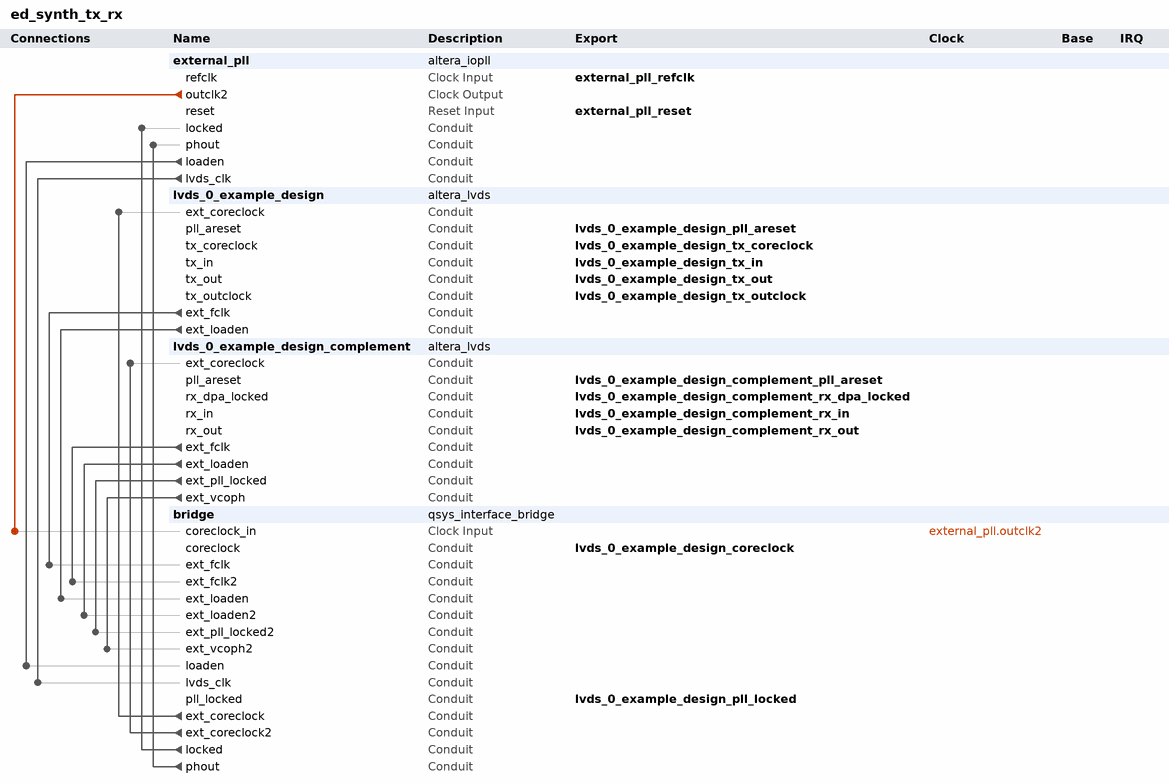
[diagram p0: system contents]
# Platform Designer (Qsys) system ed_synth_tx_rx, Cyclone 10 GX 10CX220YF780E5G
# Parameters at their usual value, and those the tool derives, are not listed.
package require -exact qsys 1.0
create_system ed_synth_tx_rx
set_project_property DEVICE_FAMILY {Cyclone 10 GX}
set_project_property DEVICE 10CX220YF780E5G

add_component external_pll ip/ed_synth_tx_rx/ed_synth_tx_rx_external_pll.ip altera_iopll external_pll 19.3.1
load_component external_pll
set_component_parameter_value gui_device_family {Cyclone 10 GX}
set_component_parameter_value gui_device_component 10CX220YF780E5G
set_component_parameter_value gui_device_speed_grade 5
set_component_parameter_value gui_debug_mode false
set_component_parameter_value gui_skip_sdc_generation false
set_component_parameter_value gui_include_iossm false
set_component_parameter_value gui_cal_code_hex_file iossm.hex
set_component_parameter_value gui_parameter_table_hex_file seq_params_sim.hex
set_component_parameter_value gui_pll_tclk_mux_en false
set_component_parameter_value gui_pll_tclk_sel pll_tclk_m_src
set_component_parameter_value gui_pll_vco_freq_band_0 pll_freq_clk0_band18
set_component_parameter_value gui_pll_vco_freq_band_1 pll_freq_clk1_band18
set_component_parameter_value gui_pll_freqcal_en true
set_component_parameter_value gui_pll_freqcal_req_flag true
set_component_parameter_value gui_cal_converge false
set_component_parameter_value gui_cal_error cal_clean
set_component_parameter_value gui_pll_cal_done false
set_component_parameter_value gui_pll_type S10_Simple
set_component_parameter_value gui_pll_m_cnt_in_src c_m_cnt_in_src_ph_mux_clk
set_component_parameter_value gui_c_cnt_in_src0 c_m_cnt_in_src_ph_mux_clk
set_component_parameter_value gui_c_cnt_in_src1 c_m_cnt_in_src_ph_mux_clk
set_component_parameter_value gui_c_cnt_in_src2 c_m_cnt_in_src_ph_mux_clk
set_component_parameter_value system_info_device_family {Cyclone 10 GX}
set_component_parameter_value system_info_device_component 10CX220YF780E5G
set_component_parameter_value system_info_device_speed_grade 5
set_component_parameter_value system_part_trait_speed_grade 5
set_component_parameter_value gui_usr_device_speed_grade 1
set_component_parameter_value gui_location_type {I/O Bank}
set_component_parameter_value gui_use_logical false
set_component_parameter_value gui_reference_clock_frequency 40.0
set_component_parameter_value gui_reference_clock_frequency_ps 10000.0
set_component_parameter_value gui_use_coreclk false
set_component_parameter_value gui_refclk_might_change false
set_component_parameter_value gui_prot_mode UNUSED
set_component_parameter_value gui_use_locked true
set_component_parameter_value gui_lock_setting {Low Lock Time}
set_component_parameter_value gui_en_lvds_ports {Enable LVDS_CLK/LOADEN 0}
set_component_parameter_value gui_operation_mode direct
set_component_parameter_value gui_clock_to_compensate 0
set_component_parameter_value gui_use_NDFB_modes false
set_component_parameter_value gui_en_phout_ports true
set_component_parameter_value gui_number_of_clocks 3
set_component_parameter_value gui_fix_vco_frequency true
set_component_parameter_value gui_fixed_vco_frequency 1280.0
set_component_parameter_value gui_fixed_vco_frequency_ps 1667.0
set_component_parameter_value gui_vco_frequency 600.0
set_component_parameter_value gui_mif_gen_options {Generate New MIF File}
set_component_parameter_value gui_new_mif_file_path {~/pll.mif}
set_component_parameter_value gui_existing_mif_file_path {~/pll.mif}
set_component_parameter_value gui_mif_config_name unnamed
set_component_parameter_value gui_enable_permit_cal false
set_component_parameter_value gui_clock_name_global false
set_component_parameter_value gui_output_clock_frequency0 1280.0
set_component_parameter_value gui_output_clock_frequency1 160.0
set_component_parameter_value gui_output_clock_frequency2 160.0
set_component_parameter_value gui_output_clock_frequency_ps0 10000.0
set_component_parameter_value gui_output_clock_frequency_ps1 10000.0
set_component_parameter_value gui_output_clock_frequency_ps2 10000.0
set_component_parameter_value gui_actual_output_clock_frequency0 1280.0
set_component_parameter_value gui_actual_output_clock_frequency1 160.0
set_component_parameter_value gui_actual_output_clock_frequency2 160.0
set_component_parameter_value gui_actual_output_clock_frequency_range0 213.333333,256.0,320.0,426.666667,640.0,1280.0
set_component_parameter_value gui_actual_output_clock_frequency_range1 116.363636,128.0,142.222222,160.0,182.857143,213.333333
set_component_parameter_value gui_actual_output_clock_frequency_range2 116.363636,128.0,142.222222,160.0,182.857143,213.333333
set_component_parameter_value gui_phase_shift0 391.0
set_component_parameter_value gui_phase_shift1 5467.0
set_component_parameter_value gui_actual_phase_shift0 390.6
set_component_parameter_value gui_actual_phase_shift1 5468.8
set_component_parameter_value gui_actual_phase_shift2 0.0
set_component_parameter_value gui_actual_phase_shift_range0 195.3,293.0,390.6,488.3,585.9,683.6
set_component_parameter_value gui_actual_phase_shift_range1 5175.8,5273.4,5371.1,5468.8,5566.4,5664.1
set_component_parameter_value gui_actual_phase_shift_range2 0.0,97.7,195.3,293.0,390.6,488.3
set_component_parameter_value gui_actual_phase_shift_deg0 180.0
set_component_parameter_value gui_actual_phase_shift_deg1 315.0
set_component_parameter_value gui_actual_phase_shift_deg2 0.0
set_component_parameter_value gui_actual_phase_shift_deg_range0 90.0,135.0,180.0,225.0,270.0,315.0
set_component_parameter_value gui_actual_phase_shift_deg_range1 298.1,303.8,309.4,315.0,320.6,326.3
set_component_parameter_value gui_actual_phase_shift_deg_range2 0.0,5.6,11.3,16.9,22.5,28.1
set_component_parameter_value gui_duty_cycle1 13.0
set_component_parameter_value gui_actual_duty_cycle0 50.0
set_component_parameter_value gui_actual_duty_cycle1 12.5
set_component_parameter_value gui_actual_duty_cycle2 50.0
set_component_parameter_value gui_actual_duty_cycle_range0 50.0
set_component_parameter_value gui_actual_duty_cycle_range1 6.25,12.5,18.75,25.0,31.25,37.5
set_component_parameter_value gui_actual_duty_cycle_range2 31.25,37.5,43.75,50.0,56.25,62.5
set_component_parameter_value parameterTable_names {M-Counter Divide Setting,N-Counter Divide Setting,VCO Frequency,C-Counter-0 Divide Setting,C-Counter-1 Divide Setting,C-Counter-2 Divide Setting,C-Counter-3 Divide Setting,C-Counter-4 Divide Setting,C-Counter-5 Divide Setting,C-Counter-6 Divide Setting,C-Counter-7 Divide Setting,C-Counter-8 Divide Setting,PLL Auto Reset,M-Counter Hi Divide,M-Counter Lo Divide,M-Counter Even Duty Enable,M-Counter Bypass Enable,N-Counter Hi Divide,N-Counter Lo Divide,N-Counter Even Duty Enable,N-Counter Bypass Enable,C-Counter-0 Hi Divide,C-Counter-1 Hi Divide,C-Counter-2 Hi Divide,C-Counter-3 Hi Divide,C-Counter-4 Hi Divide,C-Counter-5 Hi Divide,C-Counter-6 Hi Divide,C-Counter-7 Hi Divide,C-Counter-8 Hi Divide,C-Counter-0 Lo Divide,C-Counter-1 Lo Divide,C-Counter-2 Lo Divide,C-Counter-3 Lo Divide,C-Counter-4 Lo Divide,C-Counter-5 Lo Divide,C-Counter-6 Lo Divide,C-Counter-7 Lo Divide,C-Counter-8 Lo Divide,C-Counter-0 Even Duty Enable,C-Counter-1 Even Duty Enable,C-Counter-2 Even Duty Enable,C-Counter-3 Even Duty Enable,C-Counter-4 Even Duty Enable,C-Counter-5 Even Duty Enable,C-Counter-6 Even Duty Enable,C-Counter-7 Even Duty Enable,C-Counter-8 Even Duty Enable,C-Counter-0 Bypass Enable,C-Counter-1 Bypass Enable,C-Counter-2 Bypass Enable,C-Counter-3 Bypass Enable,C-Counter-4 Bypass Enable,C-Counter-5 Bypass Enable,C-Counter-6 Bypass Enable,C-Counter-7 Bypass Enable,C-Counter-8 Bypass Enable,C-Counter-0 Preset,C-Counter-1 Preset,C-Counter-2 Preset,C-Counter-3 Preset,C-Counter-4 Preset,C-Counter-5 Preset,C-Counter-6 Preset,C-Counter-7 Preset,C-Counter-8 Preset,C-Counter-0 Phase Mux Preset,C-Counter-1 Phase Mux Preset,C-Counter-2 Phase Mux Preset,C-Counter-3 Phase Mux Preset,C-Counter-4 Phase Mux Preset,C-Counter-5 Phase Mux Preset,C-Counter-6 Phase Mux Preset,C-Counter-7 Phase Mux Preset,C-Counter-8 Phase Mux Preset,Charge Pump Current,Bandwidth Control}
set_component_parameter_value parameterTable_values {32,1,1280.0 MHz,1,8,8,1,1,1,1,1,1,false,16,16,false,false,256,256,false,true,256,1,4,256,256,256,256,256,256,256,7,4,256,256,256,256,256,256,false,false,false,false,false,false,false,false,false,true,false,false,true,true,true,true,true,true,1,8,1,1,1,1,1,1,1,4,0,0,0,0,0,0,0,0,pll_cp_setting14,pll_bw_res_setting4}
set_component_parameter_value mifTable_names {The MIF file specified does not yet exist}
set_component_parameter_value pll_m_cnt_basic 1
set_component_parameter_value pll_m_cnt 1
set_component_parameter_value prot_mode BASIC
set_component_parameter_value m_cnt_hi_div 16
set_component_parameter_value eff_m_cnt 1
set_component_parameter_value multiply_factor 32
set_component_parameter_value use_core_refclk false
set_component_parameter_value m_cnt_lo_div 16
set_component_parameter_value n_cnt_hi_div 256
set_component_parameter_value n_cnt_lo_div 256
set_component_parameter_value m_cnt_bypass_en false
set_component_parameter_value n_cnt_bypass_en true
set_component_parameter_value m_cnt_odd_div_duty_en false
set_component_parameter_value n_cnt_odd_div_duty_en false
set_component_parameter_value pll_vco_div 1
set_component_parameter_value pll_cp_current pll_cp_setting14
set_component_parameter_value pll_bwctrl pll_bw_res_setting4
set_component_parameter_value pll_fractional_division 1
set_component_parameter_value fractional_vco_multiplier false
set_component_parameter_value reference_clock_frequency {40.0 MHz}
set_component_parameter_value pll_fractional_cout 1
set_component_parameter_value pll_dsm_out_sel 1st_order
set_component_parameter_value operation_mode direct
set_component_parameter_value number_of_clocks 3
set_component_parameter_value number_of_outclks 3
set_component_parameter_value pll_vcoph_div 1
set_component_parameter_value pll_type {Cyclone 10 GX}
set_component_parameter_value pll_subtype General
set_component_parameter_value pll_output_clk_frequency {1280.0 MHz}
set_component_parameter_value pll_pfd_frequency {40.0 MHz}
set_component_parameter_value mimic_fbclk_type gclk
set_component_parameter_value pll_bw_sel Low
set_component_parameter_value pll_slf_rst false
set_component_parameter_value pll_fbclk_mux_1 pll_fbclk_mux_1_glb
set_component_parameter_value pll_fbclk_mux_2 pll_fbclk_mux_2_m_cnt
set_component_parameter_value pll_m_cnt_in_src c_m_cnt_in_src_ph_mux_clk
set_component_parameter_value pll_clkin_0_src clk_0
set_component_parameter_value refclk1_frequency {100.0 MHz}
set_component_parameter_value pll_clk_loss_sw_en false
set_component_parameter_value pll_manu_clk_sw_en false
set_component_parameter_value pll_auto_clk_sw_en false
set_component_parameter_value pll_clkin_1_src clk_0
set_component_parameter_value pll_clk_sw_dly 0
set_component_parameter_value pll_extclk_0_cnt_src pll_extclk_cnt_src_vss
set_component_parameter_value pll_extclk_1_cnt_src pll_extclk_cnt_src_vss
set_component_parameter_value pll_lock_fltr_cfg 100
set_component_parameter_value pll_unlock_fltr_cfg 2
set_component_parameter_value lock_mode low_lock_time
set_component_parameter_value clock_to_compensate 0
set_component_parameter_value clock_name_global false
set_component_parameter_value pll_freqcal_en true
set_component_parameter_value pll_defer_cal_user_mode true
set_component_parameter_value dprio_interface_sel 3
set_component_parameter_value merging_permitted false
set_component_parameter_value c_cnt_hi_div0 256
set_component_parameter_value c_cnt_hi_div1 1
set_component_parameter_value c_cnt_hi_div2 4
set_component_parameter_value c_cnt_hi_div3 256
set_component_parameter_value c_cnt_hi_div4 256
set_component_parameter_value c_cnt_hi_div5 256
set_component_parameter_value c_cnt_hi_div6 256
set_component_parameter_value c_cnt_hi_div7 256
set_component_parameter_value c_cnt_hi_div8 256
set_component_parameter_value c_cnt_hi_div9 1
set_component_parameter_value c_cnt_hi_div10 1
set_component_parameter_value c_cnt_hi_div11 1
set_component_parameter_value c_cnt_hi_div12 1
set_component_parameter_value c_cnt_hi_div13 1
set_component_parameter_value c_cnt_hi_div14 1
set_component_parameter_value c_cnt_hi_div15 1
set_component_parameter_value c_cnt_hi_div16 1
set_component_parameter_value c_cnt_hi_div17 1
set_component_parameter_value c_cnt_lo_div0 256
set_component_parameter_value c_cnt_lo_div1 7
set_component_parameter_value c_cnt_lo_div2 4
set_component_parameter_value c_cnt_lo_div3 256
set_component_parameter_value c_cnt_lo_div4 256
set_component_parameter_value c_cnt_lo_div5 256
set_component_parameter_value c_cnt_lo_div6 256
set_component_parameter_value c_cnt_lo_div7 256
set_component_parameter_value c_cnt_lo_div8 256
set_component_parameter_value c_cnt_lo_div9 1
set_component_parameter_value c_cnt_lo_div10 1
set_component_parameter_value c_cnt_lo_div11 1
set_component_parameter_value c_cnt_lo_div12 1
set_component_parameter_value c_cnt_lo_div13 1
set_component_parameter_value c_cnt_lo_div14 1
set_component_parameter_value c_cnt_lo_div15 1
set_component_parameter_value c_cnt_lo_div16 1
set_component_parameter_value c_cnt_lo_div17 1
set_component_parameter_value c_cnt_prst0 1
set_component_parameter_value c_cnt_prst1 8
set_component_parameter_value c_cnt_prst2 1
set_component_parameter_value c_cnt_prst3 1
set_component_parameter_value c_cnt_prst4 1
set_component_parameter_value c_cnt_prst5 1
set_component_parameter_value c_cnt_prst6 1
set_component_parameter_value c_cnt_prst7 1
set_component_parameter_value c_cnt_prst8 1
set_component_parameter_value c_cnt_prst9 1
set_component_parameter_value c_cnt_prst10 1
set_component_parameter_value c_cnt_prst11 1
set_component_parameter_value c_cnt_prst12 1
set_component_parameter_value c_cnt_prst13 1
set_component_parameter_value c_cnt_prst14 1
set_component_parameter_value c_cnt_prst15 1
set_component_parameter_value c_cnt_prst16 1
set_component_parameter_value c_cnt_prst17 1
set_component_parameter_value c_cnt_ph_mux_prst0 4
set_component_parameter_value c_cnt_ph_mux_prst1 0
set_component_parameter_value c_cnt_ph_mux_prst2 0
set_component_parameter_value c_cnt_ph_mux_prst3 0
set_component_parameter_value c_cnt_ph_mux_prst4 0
set_component_parameter_value c_cnt_ph_mux_prst5 0
set_component_parameter_value c_cnt_ph_mux_prst6 0
set_component_parameter_value c_cnt_ph_mux_prst7 0
set_component_parameter_value c_cnt_ph_mux_prst8 0
set_component_parameter_value c_cnt_ph_mux_prst9 0
set_component_parameter_value c_cnt_ph_mux_prst10 0
set_component_parameter_value c_cnt_ph_mux_prst11 0
set_component_parameter_value c_cnt_ph_mux_prst12 0
set_component_parameter_value c_cnt_ph_mux_prst13 0
set_component_parameter_value c_cnt_ph_mux_prst14 0
set_component_parameter_value c_cnt_ph_mux_prst15 0
set_component_parameter_value c_cnt_ph_mux_prst16 0
set_component_parameter_value c_cnt_ph_mux_prst17 0
set_component_parameter_value c_cnt_in_src0 c_m_cnt_in_src_ph_mux_clk
set_component_parameter_value c_cnt_in_src1 c_m_cnt_in_src_ph_mux_clk
set_component_parameter_value c_cnt_in_src2 c_m_cnt_in_src_ph_mux_clk
set_component_parameter_value c_cnt_in_src3 c_m_cnt_in_src_ph_mux_clk
set_component_parameter_value c_cnt_in_src4 c_m_cnt_in_src_ph_mux_clk
set_component_parameter_value c_cnt_in_src5 c_m_cnt_in_src_ph_mux_clk
set_component_parameter_value c_cnt_in_src6 c_m_cnt_in_src_ph_mux_clk
set_component_parameter_value c_cnt_in_src7 c_m_cnt_in_src_ph_mux_clk
set_component_parameter_value c_cnt_in_src8 c_m_cnt_in_src_ph_mux_clk
set_component_parameter_value c_cnt_in_src9 c_m_cnt_in_src_ph_mux_clk
set_component_parameter_value c_cnt_in_src10 c_m_cnt_in_src_ph_mux_clk
set_component_parameter_value c_cnt_in_src11 c_m_cnt_in_src_ph_mux_clk
set_component_parameter_value c_cnt_in_src12 c_m_cnt_in_src_ph_mux_clk
set_component_parameter_value c_cnt_in_src13 c_m_cnt_in_src_ph_mux_clk
set_component_parameter_value c_cnt_in_src14 c_m_cnt_in_src_ph_mux_clk
set_component_parameter_value c_cnt_in_src15 c_m_cnt_in_src_ph_mux_clk
set_component_parameter_value c_cnt_in_src16 c_m_cnt_in_src_ph_mux_clk
set_component_parameter_value c_cnt_in_src17 c_m_cnt_in_src_ph_mux_clk
set_component_parameter_value c_cnt_bypass_en0 true
set_component_parameter_value c_cnt_bypass_en1 false
set_component_parameter_value c_cnt_bypass_en2 false
set_component_parameter_value c_cnt_bypass_en3 true
set_component_parameter_value c_cnt_bypass_en4 true
set_component_parameter_value c_cnt_bypass_en5 true
set_component_parameter_value c_cnt_bypass_en6 true
set_component_parameter_value c_cnt_bypass_en7 true
set_component_parameter_value c_cnt_bypass_en8 true
set_component_parameter_value c_cnt_bypass_en9 true
set_component_parameter_value c_cnt_bypass_en10 true
set_component_parameter_value c_cnt_bypass_en11 true
set_component_parameter_value c_cnt_bypass_en12 true
set_component_parameter_value c_cnt_bypass_en13 true
set_component_parameter_value c_cnt_bypass_en14 true
set_component_parameter_value c_cnt_bypass_en15 true
set_component_parameter_value c_cnt_bypass_en16 true
set_component_parameter_value c_cnt_bypass_en17 true
set_component_parameter_value c_cnt_odd_div_duty_en0 false
set_component_parameter_value c_cnt_odd_div_duty_en1 false
set_component_parameter_value c_cnt_odd_div_duty_en2 false
set_component_parameter_value c_cnt_odd_div_duty_en3 false
set_component_parameter_value c_cnt_odd_div_duty_en4 false
set_component_parameter_value c_cnt_odd_div_duty_en5 false
set_component_parameter_value c_cnt_odd_div_duty_en6 false
set_component_parameter_value c_cnt_odd_div_duty_en7 false
set_component_parameter_value c_cnt_odd_div_duty_en8 false
set_component_parameter_value c_cnt_odd_div_duty_en9 false
set_component_parameter_value c_cnt_odd_div_duty_en10 false
set_component_parameter_value c_cnt_odd_div_duty_en11 false
set_component_parameter_value c_cnt_odd_div_duty_en12 false
set_component_parameter_value c_cnt_odd_div_duty_en13 false
set_component_parameter_value c_cnt_odd_div_duty_en14 false
set_component_parameter_value c_cnt_odd_div_duty_en15 false
set_component_parameter_value c_cnt_odd_div_duty_en16 false
set_component_parameter_value c_cnt_odd_div_duty_en17 false
set_component_parameter_value output_clock_frequency0 {1280.0 MHz}
set_component_parameter_value output_clock_frequency1 {160.0 MHz}
set_component_parameter_value output_clock_frequency2 {160.0 MHz}
set_component_parameter_value output_clock_frequency3 {0 ps}
set_component_parameter_value output_clock_frequency4 {0 ps}
set_component_parameter_value output_clock_frequency5 {0 ps}
set_component_parameter_value output_clock_frequency6 {0 ps}
set_component_parameter_value output_clock_frequency7 {0 ps}
set_component_parameter_value output_clock_frequency8 {0 ps}
set_component_parameter_value output_clock_frequency9 {0 MHz}
set_component_parameter_value output_clock_frequency10 {0 MHz}
set_component_parameter_value output_clock_frequency11 {0 MHz}
set_component_parameter_value output_clock_frequency12 {0 MHz}
set_component_parameter_value output_clock_frequency13 {0 MHz}
set_component_parameter_value output_clock_frequency14 {0 MHz}
set_component_parameter_value output_clock_frequency15 {0 MHz}
set_component_parameter_value output_clock_frequency16 {0 MHz}
set_component_parameter_value output_clock_frequency17 {0 MHz}
set_component_parameter_value phase_shift0 {391 ps}
set_component_parameter_value phase_shift1 {5469 ps}
set_component_parameter_value phase_shift2 {0 ps}
set_component_parameter_value phase_shift3 {0 ps}
set_component_parameter_value phase_shift4 {0 ps}
set_component_parameter_value phase_shift5 {0 ps}
set_component_parameter_value phase_shift6 {0 ps}
set_component_parameter_value phase_shift7 {0 ps}
set_component_parameter_value phase_shift8 {0 ps}
set_component_parameter_value phase_shift9 {0 ps}
set_component_parameter_value phase_shift10 {0 ps}
set_component_parameter_value phase_shift11 {0 ps}
set_component_parameter_value phase_shift12 {0 ps}
set_component_parameter_value phase_shift13 {0 ps}
set_component_parameter_value phase_shift14 {0 ps}
set_component_parameter_value phase_shift15 {0 ps}
set_component_parameter_value phase_shift16 {0 ps}
set_component_parameter_value phase_shift17 {0 ps}
set_component_parameter_value duty_cycle0 50
set_component_parameter_value duty_cycle1 13
set_component_parameter_value duty_cycle2 50
set_component_parameter_value duty_cycle3 50
set_component_parameter_value duty_cycle4 50
set_component_parameter_value duty_cycle5 50
set_component_parameter_value duty_cycle6 50
set_component_parameter_value duty_cycle7 50
set_component_parameter_value duty_cycle8 50
set_component_parameter_value duty_cycle9 50
set_component_parameter_value duty_cycle10 50
set_component_parameter_value duty_cycle11 50
set_component_parameter_value duty_cycle12 50
set_component_parameter_value duty_cycle13 50
set_component_parameter_value duty_cycle14 50
set_component_parameter_value duty_cycle15 50
set_component_parameter_value duty_cycle16 50
set_component_parameter_value duty_cycle17 50
set_component_parameter_value clock_name_0 outclk0
set_component_parameter_value clock_name_1 outclk1
set_component_parameter_value clock_name_2 outclk2
set_component_parameter_value clock_name_global_0 false
set_component_parameter_value clock_name_global_1 false
set_component_parameter_value clock_name_global_2 false
set_component_parameter_value clock_name_global_3 false
set_component_parameter_value clock_name_global_4 false
set_component_parameter_value clock_name_global_5 false
set_component_parameter_value clock_name_global_6 false
set_component_parameter_value clock_name_global_7 false
set_component_parameter_value clock_name_global_8 false
set_component_parameter_value divide_factor0 1
set_component_parameter_value divide_factor1 1
set_component_parameter_value divide_factor2 1
set_component_parameter_value divide_factor3 1
set_component_parameter_value divide_factor4 1
set_component_parameter_value divide_factor5 1
set_component_parameter_value divide_factor6 1
set_component_parameter_value divide_factor7 1
set_component_parameter_value divide_factor8 1
set_component_parameter_value pll_tclk_mux_en false
set_component_parameter_value pll_tclk_sel pll_tclk_m_src
set_component_parameter_value pll_vco_freq_band_0 pll_freq_clk0_band18
set_component_parameter_value pll_vco_freq_band_1 pll_freq_clk1_band18
set_component_parameter_value pll_freqcal_req_flag true
set_component_parameter_value cal_converge false
set_component_parameter_value cal_error cal_clean
set_component_parameter_value pll_cal_done false
set_component_parameter_value include_iossm false
set_component_parameter_value cal_code_hex_file iossm.hex
set_component_parameter_value parameter_table_hex_file seq_params_sim.hex
set_component_parameter_value iossm_nios_sim_clk_period_ps 1333
set_component_parameter_value hp_number_of_family_allowable_clocks 9
set_component_parameter_value hp_previous_num_clocks 1
set_component_parameter_value hp_actual_vco_frequency_fp 1280.0
set_component_parameter_value hp_qsys_scripting_mode true
set_component_parameter_value hp_actual_output_clock_frequency_fp0 1280.0
set_component_parameter_value hp_actual_output_clock_frequency_fp1 160.0
set_component_parameter_value hp_actual_output_clock_frequency_fp2 160.0
set_component_parameter_value hp_actual_output_clock_frequency_fp3 100.0
set_component_parameter_value hp_actual_output_clock_frequency_fp4 100.0
set_component_parameter_value hp_actual_output_clock_frequency_fp5 100.0
set_component_parameter_value hp_actual_output_clock_frequency_fp6 100.0
set_component_parameter_value hp_actual_output_clock_frequency_fp7 100.0
set_component_parameter_value hp_actual_output_clock_frequency_fp8 100.0
set_component_parameter_value hp_actual_output_clock_frequency_fp9 100.0
set_component_parameter_value hp_actual_output_clock_frequency_fp10 100.0
set_component_parameter_value hp_actual_output_clock_frequency_fp11 100.0
set_component_parameter_value hp_actual_output_clock_frequency_fp12 100.0
set_component_parameter_value hp_actual_output_clock_frequency_fp13 100.0
set_component_parameter_value hp_actual_output_clock_frequency_fp14 100.0
set_component_parameter_value hp_actual_output_clock_frequency_fp15 100.0
set_component_parameter_value hp_actual_output_clock_frequency_fp16 100.0
set_component_parameter_value hp_actual_output_clock_frequency_fp17 100.0
set_component_parameter_value hp_actual_phase_shift_fp0 390.625
set_component_parameter_value hp_actual_phase_shift_fp1 5468.75
set_component_parameter_value hp_actual_phase_shift_fp2 0.0
set_component_parameter_value hp_actual_phase_shift_fp3 0.0
set_component_parameter_value hp_actual_phase_shift_fp4 0.0
set_component_parameter_value hp_actual_phase_shift_fp5 0.0
set_component_parameter_value hp_actual_phase_shift_fp6 0.0
set_component_parameter_value hp_actual_phase_shift_fp7 0.0
set_component_parameter_value hp_actual_phase_shift_fp8 0.0
set_component_parameter_value hp_actual_phase_shift_fp9 0.0
set_component_parameter_value hp_actual_phase_shift_fp10 0.0
set_component_parameter_value hp_actual_phase_shift_fp11 0.0
set_component_parameter_value hp_actual_phase_shift_fp12 0.0
set_component_parameter_value hp_actual_phase_shift_fp13 0.0
set_component_parameter_value hp_actual_phase_shift_fp14 0.0
set_component_parameter_value hp_actual_phase_shift_fp15 0.0
set_component_parameter_value hp_actual_phase_shift_fp16 0.0
set_component_parameter_value hp_actual_phase_shift_fp17 0.0
set_component_parameter_value hp_actual_duty_cycle_fp0 50.0
set_component_parameter_value hp_actual_duty_cycle_fp1 12.5
set_component_parameter_value hp_actual_duty_cycle_fp2 50.0
set_component_parameter_value hp_actual_duty_cycle_fp3 50.0
set_component_parameter_value hp_actual_duty_cycle_fp4 50.0
set_component_parameter_value hp_actual_duty_cycle_fp5 50.0
set_component_parameter_value hp_actual_duty_cycle_fp6 50.0
set_component_parameter_value hp_actual_duty_cycle_fp7 50.0
set_component_parameter_value hp_actual_duty_cycle_fp8 50.0
set_component_parameter_value hp_actual_duty_cycle_fp9 50.0
set_component_parameter_value hp_actual_duty_cycle_fp10 50.0
set_component_parameter_value hp_actual_duty_cycle_fp11 50.0
set_component_parameter_value hp_actual_duty_cycle_fp12 50.0
set_component_parameter_value hp_actual_duty_cycle_fp13 50.0
set_component_parameter_value hp_actual_duty_cycle_fp14 50.0
set_component_parameter_value hp_actual_duty_cycle_fp15 50.0
set_component_parameter_value hp_actual_duty_cycle_fp16 50.0
set_component_parameter_value hp_actual_duty_cycle_fp17 50.0
save_component

add_component lvds_0_example_design ip/ed_synth_tx_rx/ed_synth_tx_rx_lvds_0_example_design.ip altera_lvds lvds_0_example_design 19.5.0
load_component lvds_0_example_design
set_instance_property lvds_0_example_design AUTO_EXPORT true
set_component_parameter_value MODE TX
set_component_parameter_value DUPLEX_MODE RX_Non-DPA
set_component_parameter_value USE_EXTERNAL_PLL true
set_component_parameter_value USE_CLOCK_PIN false
set_component_parameter_value NUM_CHANNELS 1
set_component_parameter_value NUM_CHANNELS_TX 1
set_component_parameter_value J_FACTOR 8
set_component_parameter_value DATA_RATE 1280.0
set_component_parameter_value INCLOCK_FREQUENCY 40.0
set_component_parameter_value REFCLK_FROM_CORE false
set_component_parameter_value ENABLE_MIGRATABLE_PORT_MAPPINGS false
set_component_parameter_value ENABLE_UFI_COUNTER_SIM 0
set_component_parameter_value REAL_MODE TX
set_component_parameter_value ACTUAL_INCLOCK_FREQUENCY 40.0
set_component_parameter_value PORT_MAP_FILE_NAME port_map_tx.csv
set_component_parameter_value RX_USE_BITSLIP false
set_component_parameter_value RX_INCLOCK_PHASE_SHIFT 0
set_component_parameter_value RX_RCCS_VAL 0.0
set_component_parameter_value RX_BITSLIP_USE_RESET false
set_component_parameter_value RX_BITSLIP_ASSERT_MAX false
set_component_parameter_value RX_DPA_USE_RESET false
set_component_parameter_value RX_DPA_LOSE_LOCK_ON_ONE_CHANGE false
set_component_parameter_value RX_DPA_ALIGN_TO_RISING_EDGE_ONLY false
set_component_parameter_value RX_DPA_USE_HOLD false
set_component_parameter_value ENABLE_DIV_RECONFIG false
set_component_parameter_value ENABLE_CPA_RECONFIG false
set_component_parameter_value RX_FIFO_USE_RESET false
set_component_parameter_value RX_CDR_SIMULATION_PPM_DRIFT 0
set_component_parameter_value RX_INCLOCK_PHASE_SHIFT_ACTUAL 0
set_component_parameter_value RX_DPA_LOCKED_USED false
set_component_parameter_value RX_BITSLIP_ROLLOVER 8
set_component_parameter_value TX_USE_OUTCLOCK true
set_component_parameter_value TX_OUTCLOCK_DIVISION 2
set_component_parameter_value TX_OUTCLOCK_PHASE_SHIFT 0
set_component_parameter_value TX_EXPORT_CORECLOCK true
set_component_parameter_value TX_REGISTER_CLOCK tx_coreclock
set_component_parameter_value TX_OUTCLOCK_PHASE_SHIFT_ACTUAL 0
set_component_parameter_value TX_OUTCLOCK_NON_STD_PHASE_SHIFT false
set_component_parameter_value PLL_CORECLOCK_RESOURCE Periphery
set_component_parameter_value PLL_USE_RESET true
set_component_parameter_value GENERATE_SDC_FILE true
set_component_parameter_value CPA_ENABLED false
set_component_parameter_value CPA_ENABLED_SHADOW false
set_component_parameter_value DUPLEX_ENABLED false
set_component_parameter_value PLL_EXPORT_LOCK false
set_component_parameter_value pll_fclk_frequency {1280.000000 MHz}
set_component_parameter_value pll_fclk_phase_shift {391 ps}
set_component_parameter_value pll_sclk_frequency {160.000000 MHz}
set_component_parameter_value pll_sclk_phase_shift {0 ps}
set_component_parameter_value pll_loaden_frequency {160.000000 MHz}
set_component_parameter_value pll_loaden_phase_shift {5467 ps}
set_component_parameter_value pll_loaden_duty_cycle 13
set_component_parameter_value pll_tx_outclock_frequency {640.000000 MHz}
set_component_parameter_value pll_tx_outclock_phase_shift {391 ps}
set_component_parameter_value pll_tx_outclock_fclk_frequency {1280.000000 MHz}
set_component_parameter_value pll_tx_outclock_fclk_phase_shift {391 ps}
set_component_parameter_value pll_tx_outclock_loaden_frequency {160.000000 MHz}
set_component_parameter_value pll_tx_outclock_loaden_phase_shift {5467 ps}
set_component_parameter_value pll_dprio_clk_frequency {40.000000 MHz}
set_component_parameter_value pll_vco_frequency {1280.000000 MHz}
set_component_parameter_value pll_inclock_frequency {40.0 MHz}
set_component_parameter_value PLL_SPEED_GRADE 5
set_component_parameter_value DERIVED_CPA_ENABLED false
set_component_parameter_value mapped_sys_info_device_family {Cyclone 10 GX}
set_component_parameter_value mapped_sys_info_device 10CX220YF780E5G
set_component_parameter_value mapped_sys_info_device_speedgrade 5
set_component_parameter_value mapped_reference_clock_frequency {40.0 MHz}
set_component_parameter_value mapped_vco_frequency {1280.0 MHz}
set_component_parameter_value mapped_external_pll_mode true
set_component_parameter_value gui_enable_advanced_mode 0
set_component_parameter_value gui_compensation_mode direct
set_component_parameter_value gui_number_of_pll_output_clocks 0
set_component_parameter_value gui_desired_outclk_frequency_0 1280.0
set_component_parameter_value gui_actual_outclk_frequency_0 1280.000000
set_component_parameter_value hp_actual_outclk_frequency_0 1280.0
set_component_parameter_value gui_outclk_phase_shift_unit_0 0
set_component_parameter_value gui_outclk_desired_phase_shift_0 391.0
set_component_parameter_value gui_outclk_actual_phase_shift_ps_0 391
set_component_parameter_value gui_outclk_actual_phase_shift_deg_0 180.2
set_component_parameter_value hp_outclk_actual_phase_shift_0 390.625
set_component_parameter_value gui_desired_outclk_duty_cycle_0 50.0
set_component_parameter_value gui_actual_outclk_duty_cycle_0 50
set_component_parameter_value hp_actual_outclk_duty_cycle_0 50.0
set_component_parameter_value gui_desired_outclk_frequency_1 160.0
set_component_parameter_value gui_actual_outclk_frequency_1 160.000000
set_component_parameter_value hp_actual_outclk_frequency_1 160.0
set_component_parameter_value gui_outclk_phase_shift_unit_1 0
set_component_parameter_value gui_outclk_desired_phase_shift_1 5467.0
set_component_parameter_value gui_outclk_actual_phase_shift_ps_1 5467
set_component_parameter_value gui_outclk_actual_phase_shift_deg_1 314.9
set_component_parameter_value hp_outclk_actual_phase_shift_1 5468.75
set_component_parameter_value gui_desired_outclk_duty_cycle_1 13.0
set_component_parameter_value gui_actual_outclk_duty_cycle_1 13
set_component_parameter_value hp_actual_outclk_duty_cycle_1 12.5
set_component_parameter_value gui_desired_outclk_frequency_2 160.0
set_component_parameter_value gui_actual_outclk_frequency_2 160.000000
set_component_parameter_value hp_actual_outclk_frequency_2 160.0
set_component_parameter_value gui_outclk_phase_shift_unit_2 0
set_component_parameter_value gui_outclk_desired_phase_shift_2 0.0
set_component_parameter_value gui_outclk_actual_phase_shift_ps_2 0
set_component_parameter_value gui_outclk_actual_phase_shift_deg_2 0.0
set_component_parameter_value hp_outclk_actual_phase_shift_2 0.0
set_component_parameter_value gui_desired_outclk_duty_cycle_2 50.0
set_component_parameter_value gui_actual_outclk_duty_cycle_2 50
set_component_parameter_value hp_actual_outclk_duty_cycle_2 50.0
set_component_parameter_value gui_desired_outclk_frequency_3 0.0
set_component_parameter_value gui_actual_outclk_frequency_3 N/A
set_component_parameter_value hp_actual_outclk_frequency_3 1280.0
set_component_parameter_value gui_outclk_phase_shift_unit_3 0
set_component_parameter_value gui_outclk_desired_phase_shift_3 0.0
set_component_parameter_value gui_outclk_actual_phase_shift_ps_3 N/A
set_component_parameter_value gui_outclk_actual_phase_shift_deg_3 N/A
set_component_parameter_value hp_outclk_actual_phase_shift_3 0.0
set_component_parameter_value gui_desired_outclk_duty_cycle_3 0.0
set_component_parameter_value gui_actual_outclk_duty_cycle_3 N/A
set_component_parameter_value hp_actual_outclk_duty_cycle_3 50.0
set_component_parameter_value gui_desired_outclk_frequency_4 0.0
set_component_parameter_value gui_actual_outclk_frequency_4 N/A
set_component_parameter_value hp_actual_outclk_frequency_4 1280.0
set_component_parameter_value gui_outclk_phase_shift_unit_4 0
set_component_parameter_value gui_outclk_desired_phase_shift_4 0.0
set_component_parameter_value gui_outclk_actual_phase_shift_ps_4 N/A
set_component_parameter_value gui_outclk_actual_phase_shift_deg_4 N/A
set_component_parameter_value hp_outclk_actual_phase_shift_4 0.0
set_component_parameter_value gui_desired_outclk_duty_cycle_4 0.0
set_component_parameter_value gui_actual_outclk_duty_cycle_4 N/A
set_component_parameter_value hp_actual_outclk_duty_cycle_4 50.0
set_component_parameter_value gui_desired_outclk_frequency_5 100.0
set_component_parameter_value gui_actual_outclk_frequency_5 100.0
set_component_parameter_value hp_actual_outclk_frequency_5 100.0
set_component_parameter_value gui_outclk_phase_shift_unit_5 0
set_component_parameter_value gui_outclk_desired_phase_shift_5 0.0
set_component_parameter_value gui_outclk_actual_phase_shift_ps_5 0.0
set_component_parameter_value gui_outclk_actual_phase_shift_deg_5 0.0
set_component_parameter_value hp_outclk_actual_phase_shift_5 0.0
set_component_parameter_value gui_desired_outclk_duty_cycle_5 50.0
set_component_parameter_value gui_actual_outclk_duty_cycle_5 50.0
set_component_parameter_value hp_actual_outclk_duty_cycle_5 50.0
set_component_parameter_value gui_desired_outclk_frequency_6 100.0
set_component_parameter_value gui_actual_outclk_frequency_6 100.0
set_component_parameter_value hp_actual_outclk_frequency_6 100.0
set_component_parameter_value gui_outclk_phase_shift_unit_6 0
set_component_parameter_value gui_outclk_desired_phase_shift_6 0.0
set_component_parameter_value gui_outclk_actual_phase_shift_ps_6 0.0
set_component_parameter_value gui_outclk_actual_phase_shift_deg_6 0.0
set_component_parameter_value hp_outclk_actual_phase_shift_6 0.0
set_component_parameter_value gui_desired_outclk_duty_cycle_6 50.0
set_component_parameter_value gui_actual_outclk_duty_cycle_6 50.0
set_component_parameter_value hp_actual_outclk_duty_cycle_6 50.0
set_component_parameter_value gui_desired_outclk_frequency_7 100.0
set_component_parameter_value gui_actual_outclk_frequency_7 100.0
set_component_parameter_value hp_actual_outclk_frequency_7 100.0
set_component_parameter_value gui_outclk_phase_shift_unit_7 0
set_component_parameter_value gui_outclk_desired_phase_shift_7 0.0
set_component_parameter_value gui_outclk_actual_phase_shift_ps_7 0.0
set_component_parameter_value gui_outclk_actual_phase_shift_deg_7 0.0
set_component_parameter_value hp_outclk_actual_phase_shift_7 0.0
set_component_parameter_value gui_desired_outclk_duty_cycle_7 50.0
set_component_parameter_value gui_actual_outclk_duty_cycle_7 50.0
set_component_parameter_value hp_actual_outclk_duty_cycle_7 50.0
set_component_parameter_value gui_desired_outclk_frequency_8 100.0
set_component_parameter_value gui_actual_outclk_frequency_8 100.0
set_component_parameter_value hp_actual_outclk_frequency_8 100.0
set_component_parameter_value gui_outclk_phase_shift_unit_8 0
set_component_parameter_value gui_outclk_desired_phase_shift_8 0.0
set_component_parameter_value gui_outclk_actual_phase_shift_ps_8 0.0
set_component_parameter_value gui_outclk_actual_phase_shift_deg_8 0.0
set_component_parameter_value hp_outclk_actual_phase_shift_8 0.0
set_component_parameter_value gui_desired_outclk_duty_cycle_8 50.0
set_component_parameter_value gui_actual_outclk_duty_cycle_8 50.0
set_component_parameter_value hp_actual_outclk_duty_cycle_8 50.0
save_component

add_component lvds_0_example_design_complement ip/ed_synth_tx_rx/ed_synth_tx_rx_lvds_0_example_design_complement.ip altera_lvds lvds_0_example_design_complement 19.5.0
load_component lvds_0_example_design_complement
set_instance_property lvds_0_example_design_complement AUTO_EXPORT true
set_component_parameter_value MODE RX_DPA-FIFO
set_component_parameter_value DUPLEX_MODE RX_Non-DPA
set_component_parameter_value USE_EXTERNAL_PLL true
set_component_parameter_value USE_CLOCK_PIN false
set_component_parameter_value NUM_CHANNELS 1
set_component_parameter_value NUM_CHANNELS_TX 1
set_component_parameter_value J_FACTOR 8
set_component_parameter_value DATA_RATE 1280.0
set_component_parameter_value INCLOCK_FREQUENCY 40.0
set_component_parameter_value REFCLK_FROM_CORE false
set_component_parameter_value ENABLE_MIGRATABLE_PORT_MAPPINGS false
set_component_parameter_value ENABLE_UFI_COUNTER_SIM 0
set_component_parameter_value REAL_MODE RX_DPA-FIFO
set_component_parameter_value ACTUAL_INCLOCK_FREQUENCY 40.0
set_component_parameter_value PORT_MAP_FILE_NAME port_map_rx.csv
set_component_parameter_value RX_USE_BITSLIP false
set_component_parameter_value RX_INCLOCK_PHASE_SHIFT 0
set_component_parameter_value RX_RCCS_VAL 0.0
set_component_parameter_value RX_BITSLIP_USE_RESET false
set_component_parameter_value RX_BITSLIP_ASSERT_MAX false
set_component_parameter_value RX_DPA_USE_RESET false
set_component_parameter_value RX_DPA_LOSE_LOCK_ON_ONE_CHANGE false
set_component_parameter_value RX_DPA_ALIGN_TO_RISING_EDGE_ONLY false
set_component_parameter_value RX_DPA_USE_HOLD false
set_component_parameter_value ENABLE_DIV_RECONFIG false
set_component_parameter_value ENABLE_CPA_RECONFIG false
set_component_parameter_value RX_FIFO_USE_RESET false
set_component_parameter_value RX_CDR_SIMULATION_PPM_DRIFT 0
set_component_parameter_value RX_INCLOCK_PHASE_SHIFT_ACTUAL 0
set_component_parameter_value RX_DPA_LOCKED_USED true
set_component_parameter_value RX_BITSLIP_ROLLOVER 8
set_component_parameter_value TX_USE_OUTCLOCK true
set_component_parameter_value TX_OUTCLOCK_DIVISION 2
set_component_parameter_value TX_OUTCLOCK_PHASE_SHIFT 0
set_component_parameter_value TX_EXPORT_CORECLOCK true
set_component_parameter_value TX_REGISTER_CLOCK tx_coreclock
set_component_parameter_value TX_OUTCLOCK_PHASE_SHIFT_ACTUAL 0
set_component_parameter_value TX_OUTCLOCK_NON_STD_PHASE_SHIFT false
set_component_parameter_value PLL_CORECLOCK_RESOURCE Periphery
set_component_parameter_value PLL_USE_RESET true
set_component_parameter_value GENERATE_SDC_FILE true
set_component_parameter_value CPA_ENABLED false
set_component_parameter_value CPA_ENABLED_SHADOW false
set_component_parameter_value DUPLEX_ENABLED false
set_component_parameter_value PLL_EXPORT_LOCK false
set_component_parameter_value pll_fclk_frequency {1280.000000 MHz}
set_component_parameter_value pll_fclk_phase_shift {391 ps}
set_component_parameter_value pll_sclk_frequency {160.000000 MHz}
set_component_parameter_value pll_sclk_phase_shift {0 ps}
set_component_parameter_value pll_loaden_frequency {160.000000 MHz}
set_component_parameter_value pll_loaden_phase_shift {5467 ps}
set_component_parameter_value pll_loaden_duty_cycle 13
set_component_parameter_value pll_tx_outclock_frequency {0 MHz}
set_component_parameter_value pll_tx_outclock_phase_shift {0 ps}
set_component_parameter_value pll_tx_outclock_fclk_frequency {1280.000000 MHz}
set_component_parameter_value pll_tx_outclock_fclk_phase_shift {391 ps}
set_component_parameter_value pll_tx_outclock_loaden_frequency {128.000000 MHz}
set_component_parameter_value pll_tx_outclock_loaden_phase_shift {0 ps}
set_component_parameter_value pll_dprio_clk_frequency {40.000000 MHz}
set_component_parameter_value pll_vco_frequency {1280.000000 MHz}
set_component_parameter_value pll_inclock_frequency {40.0 MHz}
set_component_parameter_value PLL_SPEED_GRADE 5
set_component_parameter_value DERIVED_CPA_ENABLED false
set_component_parameter_value mapped_sys_info_device_family {Cyclone 10 GX}
set_component_parameter_value mapped_sys_info_device 10CX220YF780E5G
set_component_parameter_value mapped_sys_info_device_speedgrade 5
set_component_parameter_value mapped_reference_clock_frequency {40.0 MHz}
set_component_parameter_value mapped_vco_frequency {1280.0 MHz}
set_component_parameter_value mapped_external_pll_mode true
set_component_parameter_value gui_enable_advanced_mode 0
set_component_parameter_value gui_compensation_mode direct
set_component_parameter_value gui_number_of_pll_output_clocks 0
set_component_parameter_value gui_desired_outclk_frequency_0 1280.0
set_component_parameter_value gui_actual_outclk_frequency_0 1280.000000
set_component_parameter_value hp_actual_outclk_frequency_0 1280.0
set_component_parameter_value gui_outclk_phase_shift_unit_0 0
set_component_parameter_value gui_outclk_desired_phase_shift_0 391.0
set_component_parameter_value gui_outclk_actual_phase_shift_ps_0 391
set_component_parameter_value gui_outclk_actual_phase_shift_deg_0 180.2
set_component_parameter_value hp_outclk_actual_phase_shift_0 390.625
set_component_parameter_value gui_desired_outclk_duty_cycle_0 50.0
set_component_parameter_value gui_actual_outclk_duty_cycle_0 50
set_component_parameter_value hp_actual_outclk_duty_cycle_0 50.0
set_component_parameter_value gui_desired_outclk_frequency_1 160.0
set_component_parameter_value gui_actual_outclk_frequency_1 160.000000
set_component_parameter_value hp_actual_outclk_frequency_1 160.0
set_component_parameter_value gui_outclk_phase_shift_unit_1 0
set_component_parameter_value gui_outclk_desired_phase_shift_1 5467.0
set_component_parameter_value gui_outclk_actual_phase_shift_ps_1 5467
set_component_parameter_value gui_outclk_actual_phase_shift_deg_1 314.9
set_component_parameter_value hp_outclk_actual_phase_shift_1 5468.75
set_component_parameter_value gui_desired_outclk_duty_cycle_1 13.0
set_component_parameter_value gui_actual_outclk_duty_cycle_1 13
set_component_parameter_value hp_actual_outclk_duty_cycle_1 12.5
set_component_parameter_value gui_desired_outclk_frequency_2 160.0
set_component_parameter_value gui_actual_outclk_frequency_2 160.000000
set_component_parameter_value hp_actual_outclk_frequency_2 160.0
set_component_parameter_value gui_outclk_phase_shift_unit_2 0
set_component_parameter_value gui_outclk_desired_phase_shift_2 0.0
set_component_parameter_value gui_outclk_actual_phase_shift_ps_2 0
set_component_parameter_value gui_outclk_actual_phase_shift_deg_2 0.0
set_component_parameter_value hp_outclk_actual_phase_shift_2 0.0
set_component_parameter_value gui_desired_outclk_duty_cycle_2 50.0
set_component_parameter_value gui_actual_outclk_duty_cycle_2 50
set_component_parameter_value hp_actual_outclk_duty_cycle_2 50.0
set_component_parameter_value gui_desired_outclk_frequency_3 0.0
set_component_parameter_value gui_actual_outclk_frequency_3 N/A
set_component_parameter_value hp_actual_outclk_frequency_3 1280.0
set_component_parameter_value gui_outclk_phase_shift_unit_3 0
set_component_parameter_value gui_outclk_desired_phase_shift_3 0.0
set_component_parameter_value gui_outclk_actual_phase_shift_ps_3 N/A
set_component_parameter_value gui_outclk_actual_phase_shift_deg_3 N/A
set_component_parameter_value hp_outclk_actual_phase_shift_3 0.0
set_component_parameter_value gui_desired_outclk_duty_cycle_3 0.0
set_component_parameter_value gui_actual_outclk_duty_cycle_3 N/A
set_component_parameter_value hp_actual_outclk_duty_cycle_3 50.0
set_component_parameter_value gui_desired_outclk_frequency_4 0.0
set_component_parameter_value gui_actual_outclk_frequency_4 N/A
set_component_parameter_value hp_actual_outclk_frequency_4 1280.0
set_component_parameter_value gui_outclk_phase_shift_unit_4 0
set_component_parameter_value gui_outclk_desired_phase_shift_4 0.0
set_component_parameter_value gui_outclk_actual_phase_shift_ps_4 N/A
set_component_parameter_value gui_outclk_actual_phase_shift_deg_4 N/A
set_component_parameter_value hp_outclk_actual_phase_shift_4 0.0
set_component_parameter_value gui_desired_outclk_duty_cycle_4 0.0
set_component_parameter_value gui_actual_outclk_duty_cycle_4 N/A
set_component_parameter_value hp_actual_outclk_duty_cycle_4 50.0
set_component_parameter_value gui_desired_outclk_frequency_5 100.0
set_component_parameter_value gui_actual_outclk_frequency_5 100.0
set_component_parameter_value hp_actual_outclk_frequency_5 100.0
set_component_parameter_value gui_outclk_phase_shift_unit_5 0
set_component_parameter_value gui_outclk_desired_phase_shift_5 0.0
set_component_parameter_value gui_outclk_actual_phase_shift_ps_5 0.0
set_component_parameter_value gui_outclk_actual_phase_shift_deg_5 0.0
set_component_parameter_value hp_outclk_actual_phase_shift_5 0.0
set_component_parameter_value gui_desired_outclk_duty_cycle_5 50.0
set_component_parameter_value gui_actual_outclk_duty_cycle_5 50.0
set_component_parameter_value hp_actual_outclk_duty_cycle_5 50.0
set_component_parameter_value gui_desired_outclk_frequency_6 100.0
set_component_parameter_value gui_actual_outclk_frequency_6 100.0
set_component_parameter_value hp_actual_outclk_frequency_6 100.0
set_component_parameter_value gui_outclk_phase_shift_unit_6 0
set_component_parameter_value gui_outclk_desired_phase_shift_6 0.0
set_component_parameter_value gui_outclk_actual_phase_shift_ps_6 0.0
set_component_parameter_value gui_outclk_actual_phase_shift_deg_6 0.0
set_component_parameter_value hp_outclk_actual_phase_shift_6 0.0
set_component_parameter_value gui_desired_outclk_duty_cycle_6 50.0
set_component_parameter_value gui_actual_outclk_duty_cycle_6 50.0
set_component_parameter_value hp_actual_outclk_duty_cycle_6 50.0
set_component_parameter_value gui_desired_outclk_frequency_7 100.0
set_component_parameter_value gui_actual_outclk_frequency_7 100.0
set_component_parameter_value hp_actual_outclk_frequency_7 100.0
set_component_parameter_value gui_outclk_phase_shift_unit_7 0
set_component_parameter_value gui_outclk_desired_phase_shift_7 0.0
set_component_parameter_value gui_outclk_actual_phase_shift_ps_7 0.0
set_component_parameter_value gui_outclk_actual_phase_shift_deg_7 0.0
set_component_parameter_value hp_outclk_actual_phase_shift_7 0.0
set_component_parameter_value gui_desired_outclk_duty_cycle_7 50.0
set_component_parameter_value gui_actual_outclk_duty_cycle_7 50.0
set_component_parameter_value hp_actual_outclk_duty_cycle_7 50.0
set_component_parameter_value gui_desired_outclk_frequency_8 100.0
set_component_parameter_value gui_actual_outclk_frequency_8 100.0
set_component_parameter_value hp_actual_outclk_frequency_8 100.0
set_component_parameter_value gui_outclk_phase_shift_unit_8 0
set_component_parameter_value gui_outclk_desired_phase_shift_8 0.0
set_component_parameter_value gui_outclk_actual_phase_shift_ps_8 0.0
set_component_parameter_value gui_outclk_actual_phase_shift_deg_8 0.0
set_component_parameter_value hp_outclk_actual_phase_shift_8 0.0
set_component_parameter_value gui_desired_outclk_duty_cycle_8 50.0
set_component_parameter_value gui_actual_outclk_duty_cycle_8 50.0
set_component_parameter_value hp_actual_outclk_duty_cycle_8 50.0
save_component
